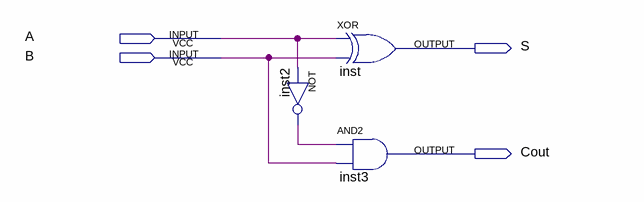
[diagram p0: schematic sheet]
// Quartus schematic half_subtractor.bdf as structural Verilog: 3 symbols, 4 pins
module half_subtractor (
  input  A,
  input  B,
  output S,
  output Cout
);

  wire inst2_out;

  not inst2 (inst2_out, A);
  xor inst (S, A, B);
  and inst3 (Cout, inst2_out, B);
endmodule
